# Altium schematic sheet connector.SchDoc
size A4
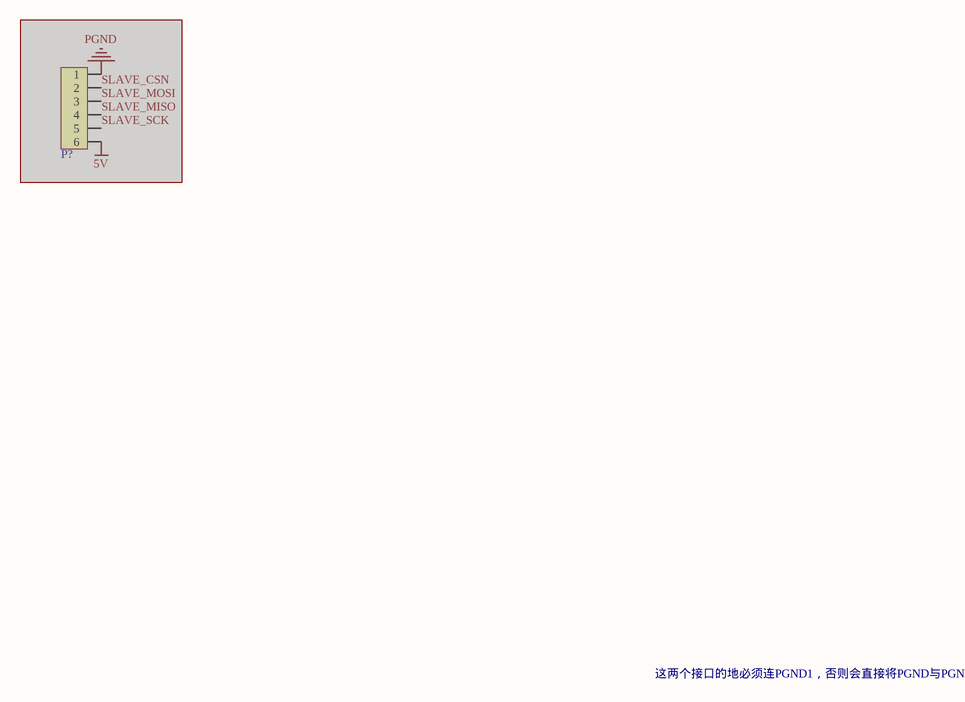
[diagram p0: connector.SchDoc]

## Parts
P?  HDR1x6_2.54  [1.25mm_1X6_SMT]  (value not drawn)  (masked out: inside a compile mask, not in the netlist)

## Notes on the sheet
- 这两个接口的地必须连PGND1，否则会直接将PGND与PGND1短路，造成开关电路失效

## Library data of the parts
P? = HDR1x6_2.54T: Header